# EAGLE schematic MuffsyRelayInput2 (EAGLE 9.1.3)

## Sheet 1 of 2
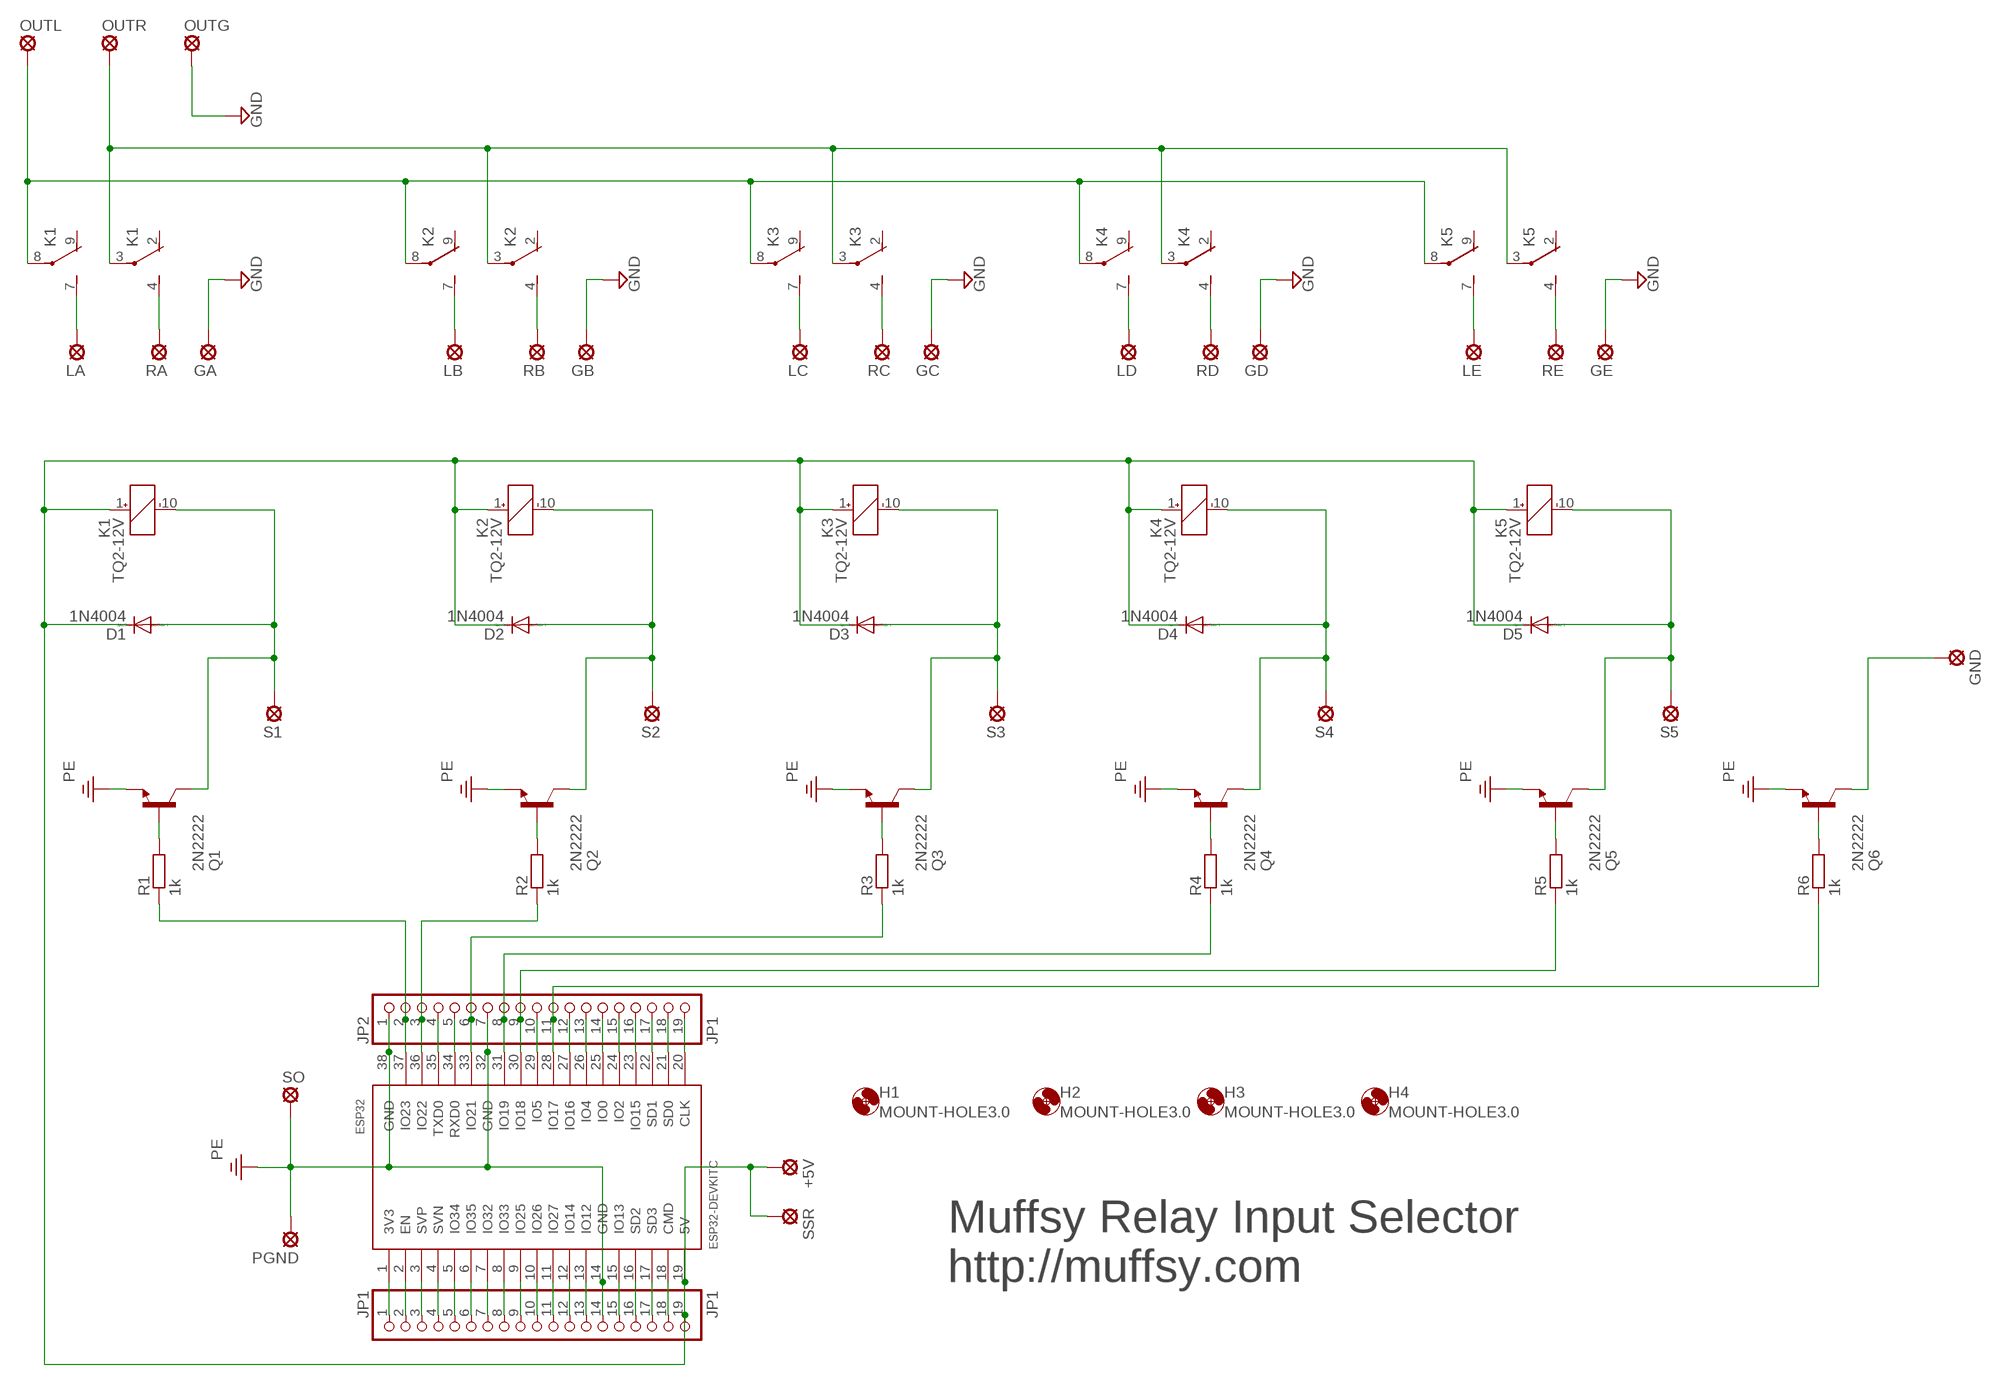
[diagram p0: schematic, sheet 1]

### Parts
+5V  SE11  [SE11]
D1  1N4004  [DO41-10]
D2  1N4004  [DO41-10]
D3  1N4004  [DO41-10]
D4  1N4004  [DO41-10]
D5  1N4004  [DO41-10]
ESP32  ESP32DEVKITC  [ESP32-DEVKITC]
GA  SE11  [SE11]
GB  SE11  [SE11]
GC  SE11  [SE11]
GD  SE11  [SE11]
GE  SE11  [SE11]
GND  SE11  [SE11]
H1  MOUNT-HOLE3.0  [3,0]
H2  MOUNT-HOLE3.0  [3,0]
H3  MOUNT-HOLE3.0  [3,0]
H4  MOUNT-HOLE3.0  [3,0]
JP1  JP1  PINHD-1X19  [1X19]
JP2  JP1  PINHD-1X19  [1X19]
K1  TQ2-12V  [TQ2]
K2  TQ2-12V  [TQ2]
K3  TQ2-12V  [TQ2]
K4  TQ2-12V  [TQ2]
K5  TQ2-12V  [TQ2]
LA  SE11  [SE11]
LB  SE11  [SE11]
LC  SE11  [SE11]
LD  SE11  [SE11]
LE  SE11  [SE11]
OUTG  SE11  [SE11]
OUTL  SE11  [SE11]
OUTR  SE11  [SE11]
PGND  SE11  [SE11]
Q1  2N2222  [TO18]
Q2  2N2222  [TO18]
Q3  2N2222  [TO18]
Q4  2N2222  [TO18]
Q5  2N2222  [TO18]
Q6  2N2222  [TO18]
R1  1k  R-EU_0207/10  [0207/10]
R2  1k  R-EU_0207/10  [0207/10]
R3  1k  R-EU_0207/10  [0207/10]
R4  1k  R-EU_0207/10  [0207/10]
R5  1k  R-EU_0207/10  [0207/10]
R6  1k  R-EU_0207/10  [0207/10]
RA  SE11  [SE11]
RB  SE11  [SE11]
RC  SE11  [SE11]
RD  SE11  [SE11]
RE  SE11  [SE11]
S1  SE11  [SE11]
S2  SE11  [SE11]
S3  SE11  [SE11]
S4  SE11  [SE11]
S5  SE11  [SE11]
SO  SE11  [SE11]
SSR  SE11  [SE11]

### Nets
GND: GA.MP GB.MP GC.MP GD.MP GE.MP OUTG.MP
N$1: K2.7(2:S) LB.MP
N$2: K1.7(2:S) LA.MP
N$3: K1.4(1:S) RA.MP
N$4: K2.4(1:S) RB.MP
N$5: K3.7(2:S) LC.MP
N$6: K3.4(1:S) RC.MP
N$7: K4.7(2:S) LD.MP
N$8: K4.4(1:S) RD.MP
N$9: K5.7(2:S) LE.MP
N$10: K5.4(1:S) RE.MP
N$11: Q1.2(B) R1.2
N$12: K1.3(1:P) K2.3(1:P) K3.3(1:P) K4.3(1:P) K5.3(1:P) OUTR.MP
N$13: K1.8(2:P) K2.8(2:P) K3.8(2:P) K4.8(2:P) K5.8(2:P) OUTL.MP
N$14: Q2.2(B) R2.2
N$15: +5V.MP D1.C D2.C D3.C D4.C D5.C ESP32.19(5V) JP1.19 K1.1(_:+) K2.1(_:+) K3.1(_:+) K4.1(_:+) K5.1(_:+) SSR.MP
N$16: Q3.2(B) R3.2
N$17: Q4.2(B) R4.2
N$18: Q5.2(B) R5.2
N$19: ESP32.1(3V3) JP1.1
N$20: D1.A K1.10(_:-) Q1.3(C) S1.MP
N$21: D2.A K2.10(_:-) Q2.3(C) S2.MP
N$22: D3.A K3.10(_:-) Q3.3(C) S3.MP
N$23: D4.A K4.10(_:-) Q4.3(C) S4.MP
N$24: D5.A K5.10(_:-) Q5.3(C) S5.MP
N$25: ESP32.2(EN) JP1.2
N$26: ESP32.3(SVP) JP1.3
N$27: ESP32.4(SVN) JP1.4
N$28: ESP32.5(IO34) JP1.5
N$29: ESP32.6(IO35) JP1.6
N$30: ESP32.7(IO32) JP1.7
N$31: ESP32.8(IO33) JP1.8
N$32: ESP32.9(IO25) JP1.9
N$33: ESP32.10(IO26) JP1.10
N$34: ESP32.11(IO27) JP1.11
N$35: ESP32.12(IO14) JP1.12
N$36: ESP32.13(IO12) JP1.13
N$37: GND.MP Q6.3(C)
N$38: ESP32.15(IO13) JP1.15
N$39: Q6.2(B) R6.2
N$40: ESP32.29(IO5) JP2.10
N$44: ESP32.16(SD2) JP1.16
N$45: ESP32.17(SD3) JP1.17
N$46: ESP32.18(CMD) JP1.18
N$49: ESP32.37(IO23) JP2.2 R1.1
N$50: ESP32.36(IO22) JP2.3 R2.1
N$51: ESP32.35(TXD0) JP2.4
N$52: ESP32.34(RXD0) JP2.5
N$53: ESP32.33(IO21) JP2.6 R3.1
N$55: ESP32.31(IO19) JP2.8 R4.1
N$56: ESP32.30(IO18) JP2.9 R5.1
N$58: ESP32.28(IO17) JP2.11 R6.1
N$59: ESP32.27(IO16) JP2.12
N$60: ESP32.26(IO4) JP2.13
N$61: ESP32.25(IO0) JP2.14
N$62: ESP32.24(IO2) JP2.15
N$63: ESP32.23(IO15) JP2.16
N$64: ESP32.22(SD1) JP2.17
N$65: ESP32.21(SD0) JP2.18
N$66: ESP32.20(CLK) JP2.19
PE: ESP32.14(GND) ESP32.32(GND) ESP32.38(GND) JP1.14 JP2.1 JP2.7 PGND.MP Q1.1(E) Q2.1(E) Q3.1(E) Q4.1(E) Q5.1(E) Q6.1(E) SO.MP
Unconnected: K1.2(1:O) K1.9(2:O) K2.2(1:O) K2.9(2:O) K3.2(1:O) K3.9(2:O) K4.2(1:O) K4.9(2:O) K5.2(1:O) K5.9(2:O)

### Notes on the sheet
- Muffsy Relay Input Selector
- http://muffsy.com

## Sheet 2 of 2

## Library data of the parts
+5V GA GB GC GD GE GND LA LB LC LD LE OUTG OUTL OUTR PGND RA RB RC RD RE S1-S5 SO SSR = relswitch:SE11: SOLDER PAD RTM, drill 1,1mm, distributor Buerklin, 07F810
D1-D5 = relswitch:1N4004: DIODE general purpose rectifier, 1 A
ESP32 = relswitch:ESP32DEVKITC
H1-H4 = relswitch:MOUNT-HOLE: MOUNTING HOLE with drill center marker
JP1 JP2 = relswitch:PINHD-1X19: PIN HEADER
K1-K5 = relswitch:TQ2?*: LOW PROFILE 2 FORM C RELAY NAiS Source: http://www.mew-europe.com/.. en_ds_61020_0001.pdf Source: http://www.mew-europe.com/.. en_ds_61020_0004.pdf; MF: AROMAT/ MATSUSHITA; MPN: TQ2-12V; OC_FARNELL: 1200949; OC_NEWARK: 64K3197
Q1-Q6 = relswitch:2N2222*: NPN Transistor
R1-R6 = relswitch:R-EU_: RESISTOR, European symbol